# EAGLE design 527_aiblocks (EAGLE 9.6.2)
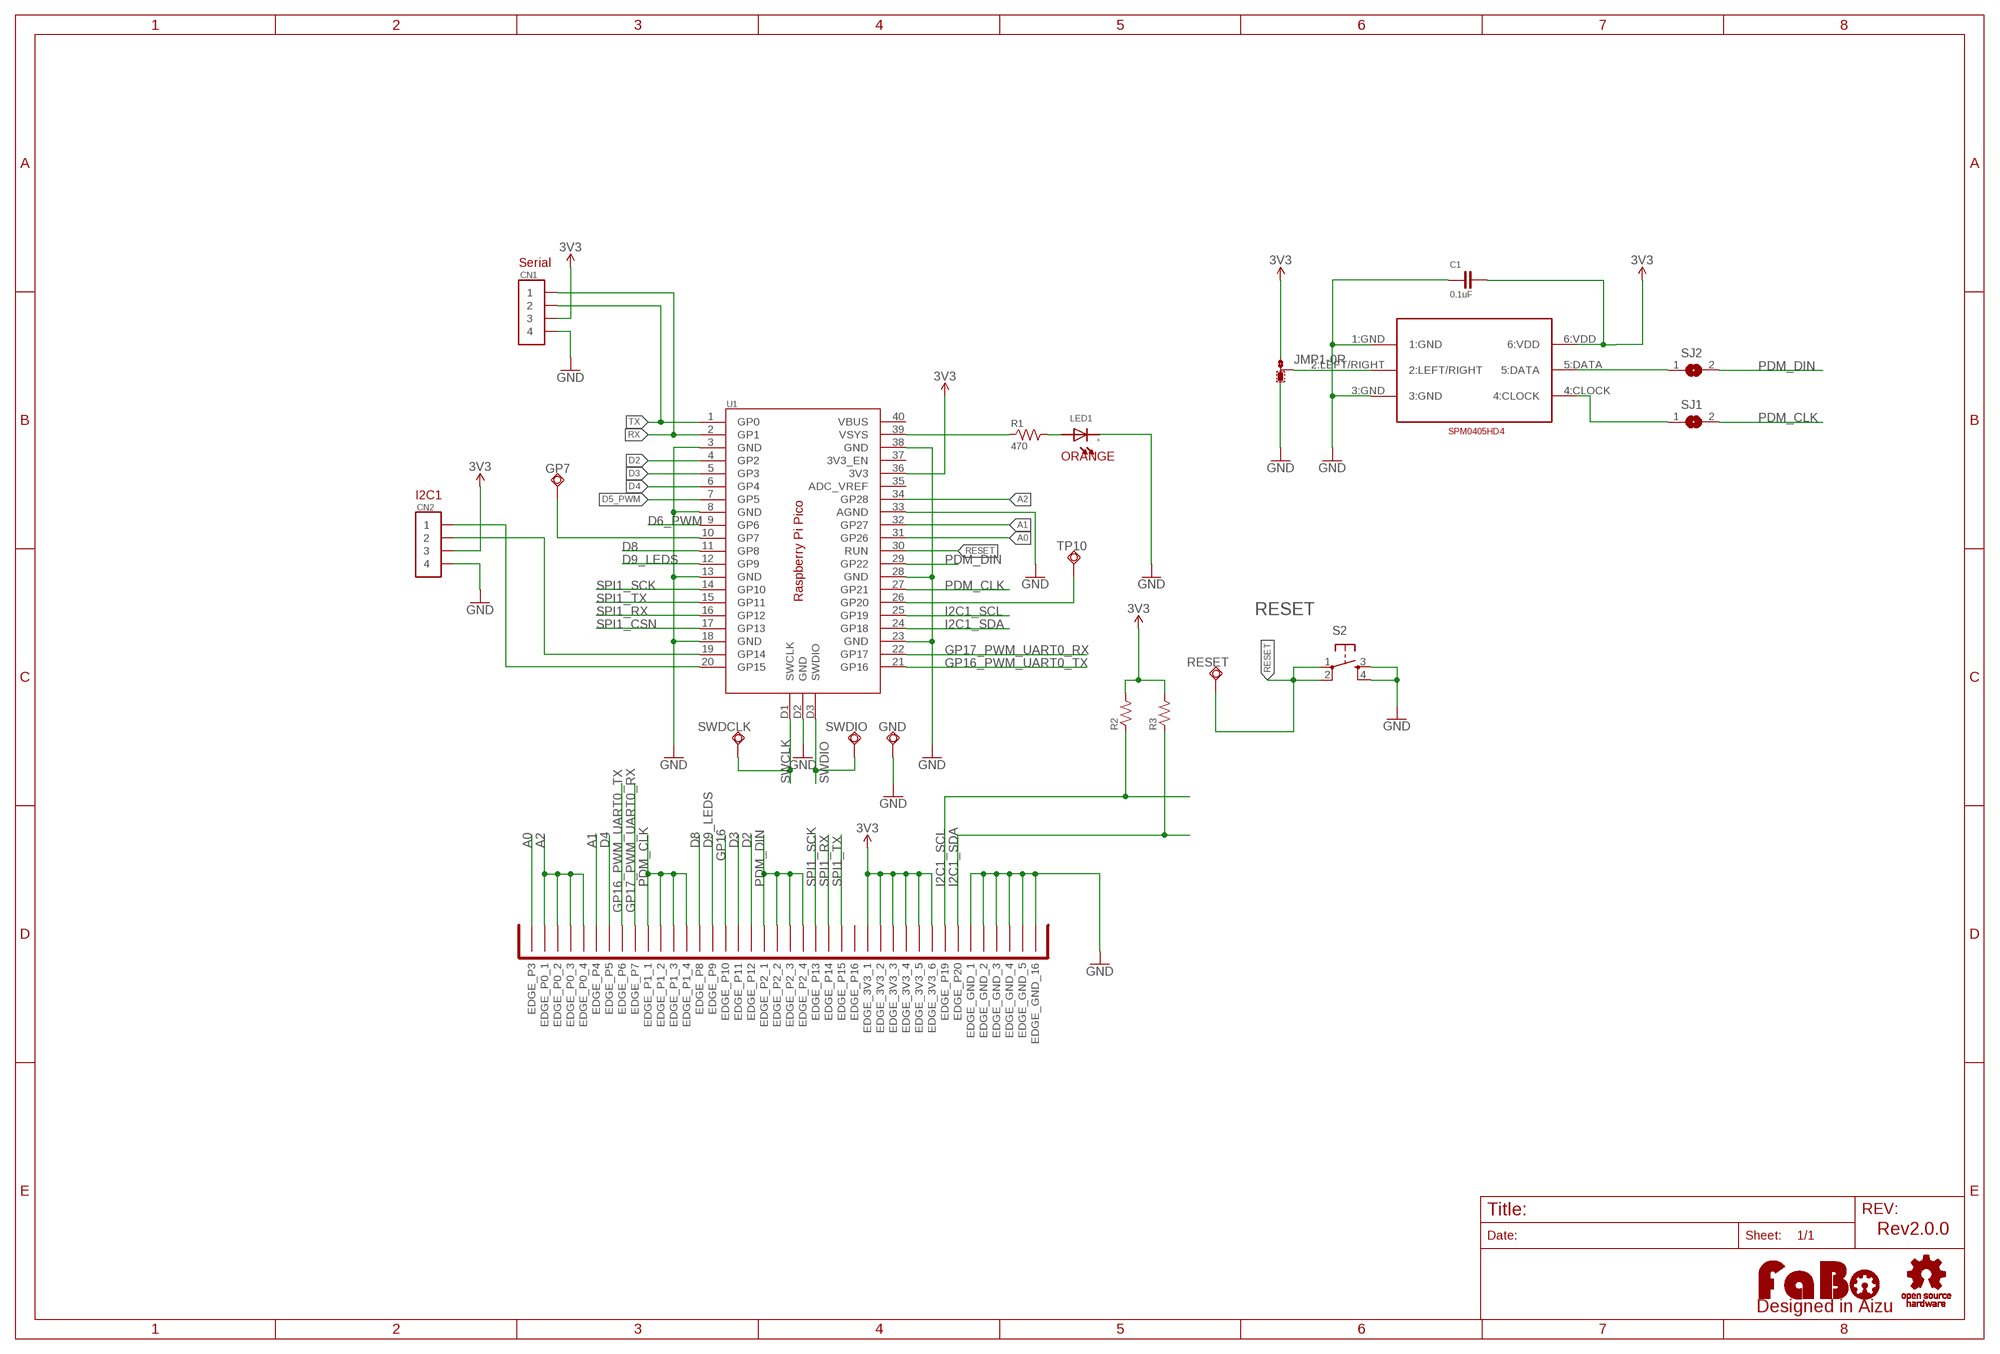
[diagram p0: schematic, sheet 1]

## Parts
C1  0.1uF  CAPACITOR-0402  [0402]
CN1  SMD-CONN-4PIN-SM04B-PASS  [SM04B-PASS]
CN2  SMD-CONN-4PIN-SM04B-PASS  [SM04B-PASS]
GND  TPSQTP20R  [TP20R]
GP7  TPSQTP20R  [TP20R]
JMP1  0R-JUMPA  [A0R-JMP]
LED1  LED-0603  [0603]
LOGO1  LOGO_OSHW-M_BOTTOM  [LOGO_OSHW_M_BOTTOM]
LOGO2  LOGO_FABO-M  [LOGO_FABO_M]
R1  470  RESISTOR-0603  [0603]
R2  RESISTOR-0603  [0603]
R3  RESISTOR-0603  [0603]
RESET  TPSQTP20R  [TP20R]
S2  TACT-SWITCH-SMD_KMR2  [KMR2]
SJ1  SJW  [SJW]
SJ2  SJW  [SJW]
SWDCLK  TPSQTP20R  [TP20R]
SWDIO  TPSQTP20R  [TP20R]
TP10  TPSQTP20R  [TP20R]
U1  RASPBERRY_PI_PICO  [RASPBERRY_PI_PICO_SMD]
U$1  SPM0405H  [SPM4050]
U$2  BBC_EDGE  [BBC_EDGE]

## Nets
3V3: C1.2 CN1.3 CN2.3 JMP1.1 R2.2 R3.2 U1.36(3V3) U$1.6:VDD U$2.P$27(EDGE_3V3_1) U$2.P$28(EDGE_3V3_2) U$2.P$29(EDGE_3V3_3) U$2.P$30(EDGE_3V3_4) U$2.P$31(EDGE_3V3_5) U$2.P$32(EDGE_3V3_6) U$2.P$67(EDGE_3V3_1) U$2.P$68(EDGE_3V3_2) U$2.P$69(EDGE_3V3_3) U$2.P$70(EDGE_3V3_4) U$2.P$71(EDGE_3V3_5) U$2.P$72(EDGE_3V3_6)
A0: U1.31(GP26) U$2.P$1(EDGE_P3) U$2.P$41(EDGE_P3)
A1: U1.32(GP27) U$2.P$6(EDGE_P4) U$2.P$46(EDGE_P4)
A2: U1.34(GP28) U$2.P$2(EDGE_P0_1) U$2.P$3(EDGE_P0_2) U$2.P$4(EDGE_P0_3) U$2.P$5(EDGE_P0_4) U$2.P$42(EDGE_P0_1) U$2.P$43(EDGE_P0_2) U$2.P$44(EDGE_P0_3) U$2.P$45(EDGE_P0_4)
D2: U1.4(GP2) U$2.P$18(EDGE_P12) U$2.P$58(EDGE_P12)
D3: U1.5(GP3) U$2.P$17(EDGE_P11) U$2.P$57(EDGE_P11)
D4: U1.6(GP4) U$2.P$7(EDGE_P5) U$2.P$47(EDGE_P5)
D5_PWM: U1.7(GP5)
D6_PWM: U1.9(GP6)
D8: U1.11(GP8) U$2.P$14(EDGE_P8) U$2.P$54(EDGE_P8)
D9_LEDS: U1.12(GP9) U$2.P$15(EDGE_P9) U$2.P$55(EDGE_P9)
GND: C1.1 CN1.4 CN2.4 GND.TP JMP1.3 LED1.CATHODE S2.3 S2.4 U1.3(GND) U1.8(GND) U1.13(GND) U1.18(GND) U1.23(GND) U1.28(GND) U1.33(AGND) U1.38(GND) U1.D2(GND) U$1.1:GND U$1.3:GND U$2.P$35(EDGE_GND_1) U$2.P$36(EDGE_GND_2) U$2.P$37(EDGE_GND_3) U$2.P$38(EDGE_GND_4) U$2.P$39(EDGE_GND_5) U$2.P$40(EDGE_GND_16) U$2.P$75(EDGE_GND_1) U$2.P$76(EDGE_GND_2) U$2.P$77(EDGE_GND_3) U$2.P$78(EDGE_GND_4) U$2.P$79(EDGE_GND_5) U$2.P$80(EDGE_GND_16)
GP14: CN2.2 U1.19(GP14)
GP15: CN2.1 U1.20(GP15)
GP16: U$2.P$16(EDGE_P10) U$2.P$56(EDGE_P10)
GP16_PWM_UART0_TX: U1.21(GP16) U$2.P$8(EDGE_P6) U$2.P$48(EDGE_P6)
GP17_PWM_UART0_RX: U1.22(GP17) U$2.P$9(EDGE_P7) U$2.P$49(EDGE_P7)
I2C1_SCL: R2.1 U1.25(GP19) U$2.P$33(EDGE_P19) U$2.P$73(EDGE_P19)
I2C1_SDA: R3.1 U1.24(GP18) U$2.P$34(EDGE_P20) U$2.P$74(EDGE_P20)
N$1: R1.1 U1.39(VSYS)
N$2: LED1.ANODE R1.2
N$3: GP7.TP U1.10(GP7)
N$4: TP10.TP U1.26(GP20)
N$5: JMP1.2 U$1.2:LEFT/RIGHT
N$6: SJ1.1 U$1.4:CLOCK
N$7: SJ2.1 U$1.5:DATA
PDM_CLK: SJ1.2 U1.27(GP21) U$2.P$10(EDGE_P1_1) U$2.P$11(EDGE_P1_2) U$2.P$12(EDGE_P1_3) U$2.P$13(EDGE_P1_4) U$2.P$50(EDGE_P1_1) U$2.P$51(EDGE_P1_2) U$2.P$52(EDGE_P1_3) U$2.P$53(EDGE_P1_4)
PDM_DIN: SJ2.2 U1.29(GP22) U$2.P$19(EDGE_P2_1) U$2.P$20(EDGE_P2_2) U$2.P$21(EDGE_P2_3) U$2.P$22(EDGE_P2_4) U$2.P$59(EDGE_P2_1) U$2.P$60(EDGE_P2_2) U$2.P$61(EDGE_P2_3) U$2.P$62(EDGE_P2_4)
RESET: RESET.TP S2.1 S2.2 U1.30(RUN)
RX: CN1.1 U1.2(GP1)
SPI1_CSN: U1.17(GP13)
SPI1_RX: U1.16(GP12) U$2.P$24(EDGE_P14) U$2.P$64(EDGE_P14)
SPI1_SCK: U1.14(GP10) U$2.P$23(EDGE_P13) U$2.P$63(EDGE_P13)
SPI1_TX: U1.15(GP11) U$2.P$25(EDGE_P15) U$2.P$65(EDGE_P15)
SWCLK: SWDCLK.TP U1.D1(SWCLK)
SWDIO: SWDIO.TP U1.D3(SWDIO)
TX: CN1.2 U1.1(GP0)
Unconnected: U1.35(ADC_VREF) U1.37(3V3_EN) U1.40(VBUS) U$2.P$26(EDGE_P16) U$2.P$66(EDGE_P16)

## Notes on the sheet
- Serial
- ORANGE
- I2C1
- RESET
- Rev2.0.0

## Library data of the parts
C1 = FaBo-Capacitor:CAPACITOR: CAPACITOR
CN1 CN2 = FaBo-Connetor:SMD-CONN-4PIN
GND GP7 RESET SWDCLK SWDIO TP10 = testpad:TPSQ: Test pad
JMP1 = jump-0r-smd:0R-JUMP: SMD 0R 0805 Jumper
LED1 = FaBo-LED:LED
LOGO1 = FaBo-Logo:LOGO_OSHW
LOGO2 = FaBo-Logo:LOGO_FABO
R1-R3 = FaBo-Resistors:RESISTOR: RESISTOR
S2 = FaBo-Switch:TACT-SWITCH: Part No Maker Datasheet Distributor 1273HA-160G-G SWITRONIC Catalog <http://www.switronic.com/uploads/images/A10.gif> Akizuki <http://akizukidenshi.com/catalog/g/gP-02561/> DTS-6-V Cosland DTS 6 Series <http://www.cosland.com/newproduct/DTS%20SERIES.pdf> Akizuki <http://akizukidenshi.com/catalog/g/gP-03647/> KMR2 C&K KMR2 SERIES <https://www.ckswitches.com/products/switches/product-details/Tactile/KMR2/> Octoparts Result <https://octopart.com/search?q=KMR2&start=0> TSHA-T-XB2-19E TOP UP INDUSTORY TSHA-T <http://www.top-up.com.tw/front/bin/ptdetail.phtml?Part=TSHA-T> Akizuki <http://akizukidenshi.com/catalog/g/gP-09361/>
SJ1 SJ2 = jumper:SJ: SMD solder JUMPER
U1 = FaBo-Boards:RASPBERRY_PI_PICO
U$1 = FaBo-Sensor:SPM0405H
U$2 = microbit:BBC_EDGE

## Board
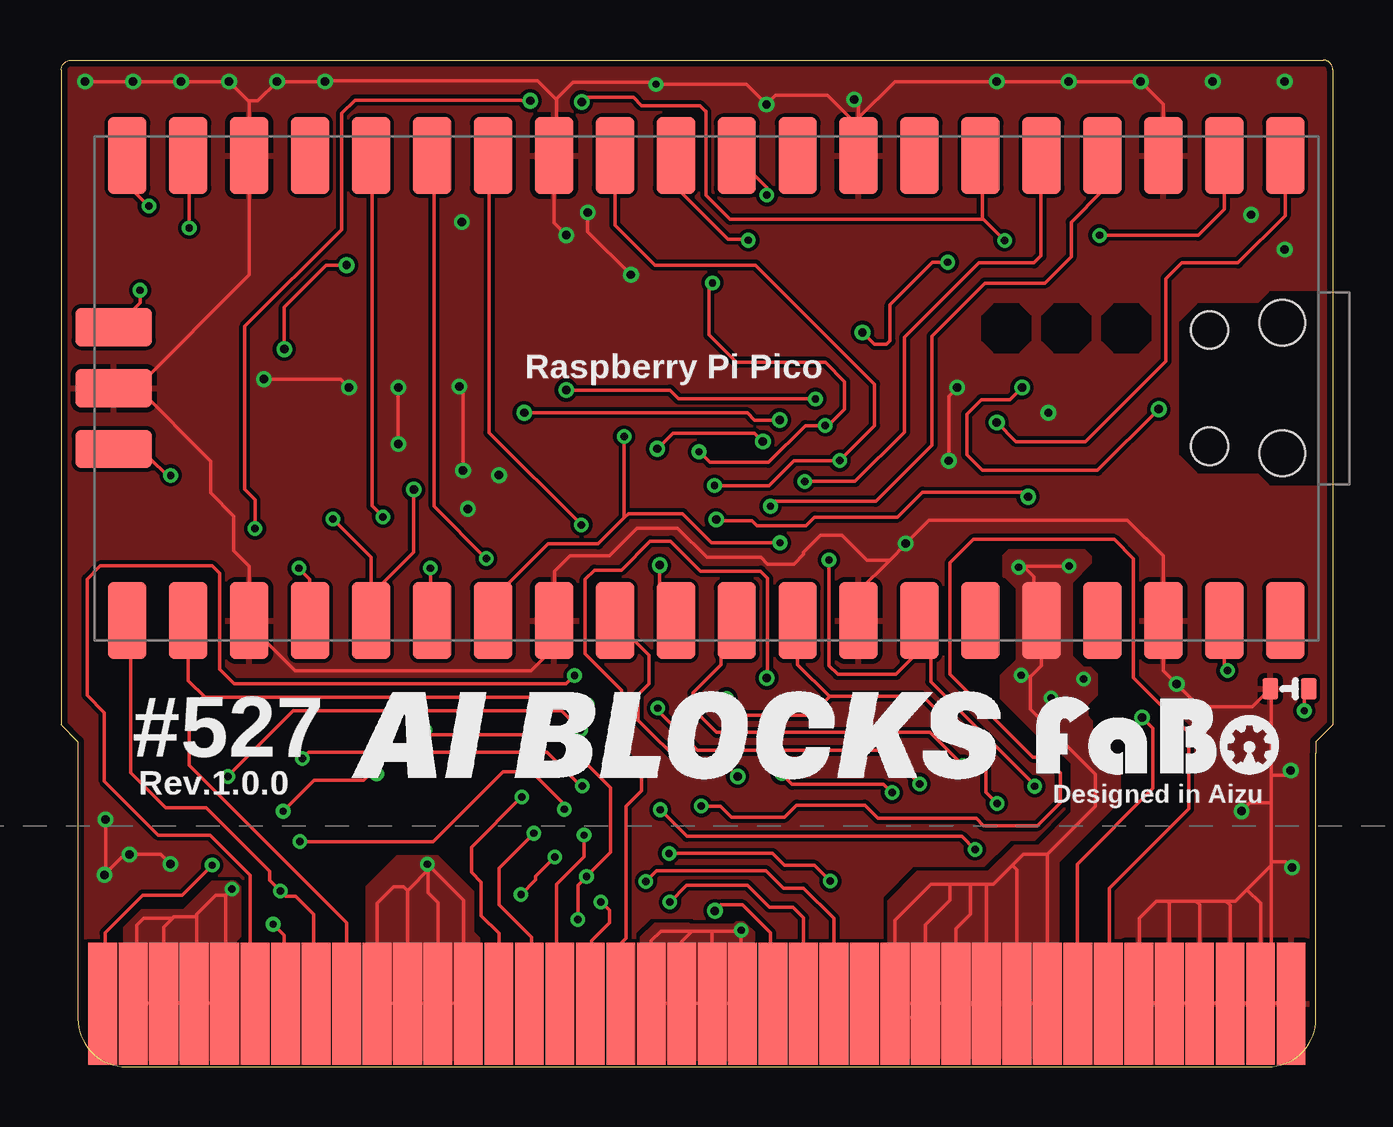
[diagram p1: board, top side]
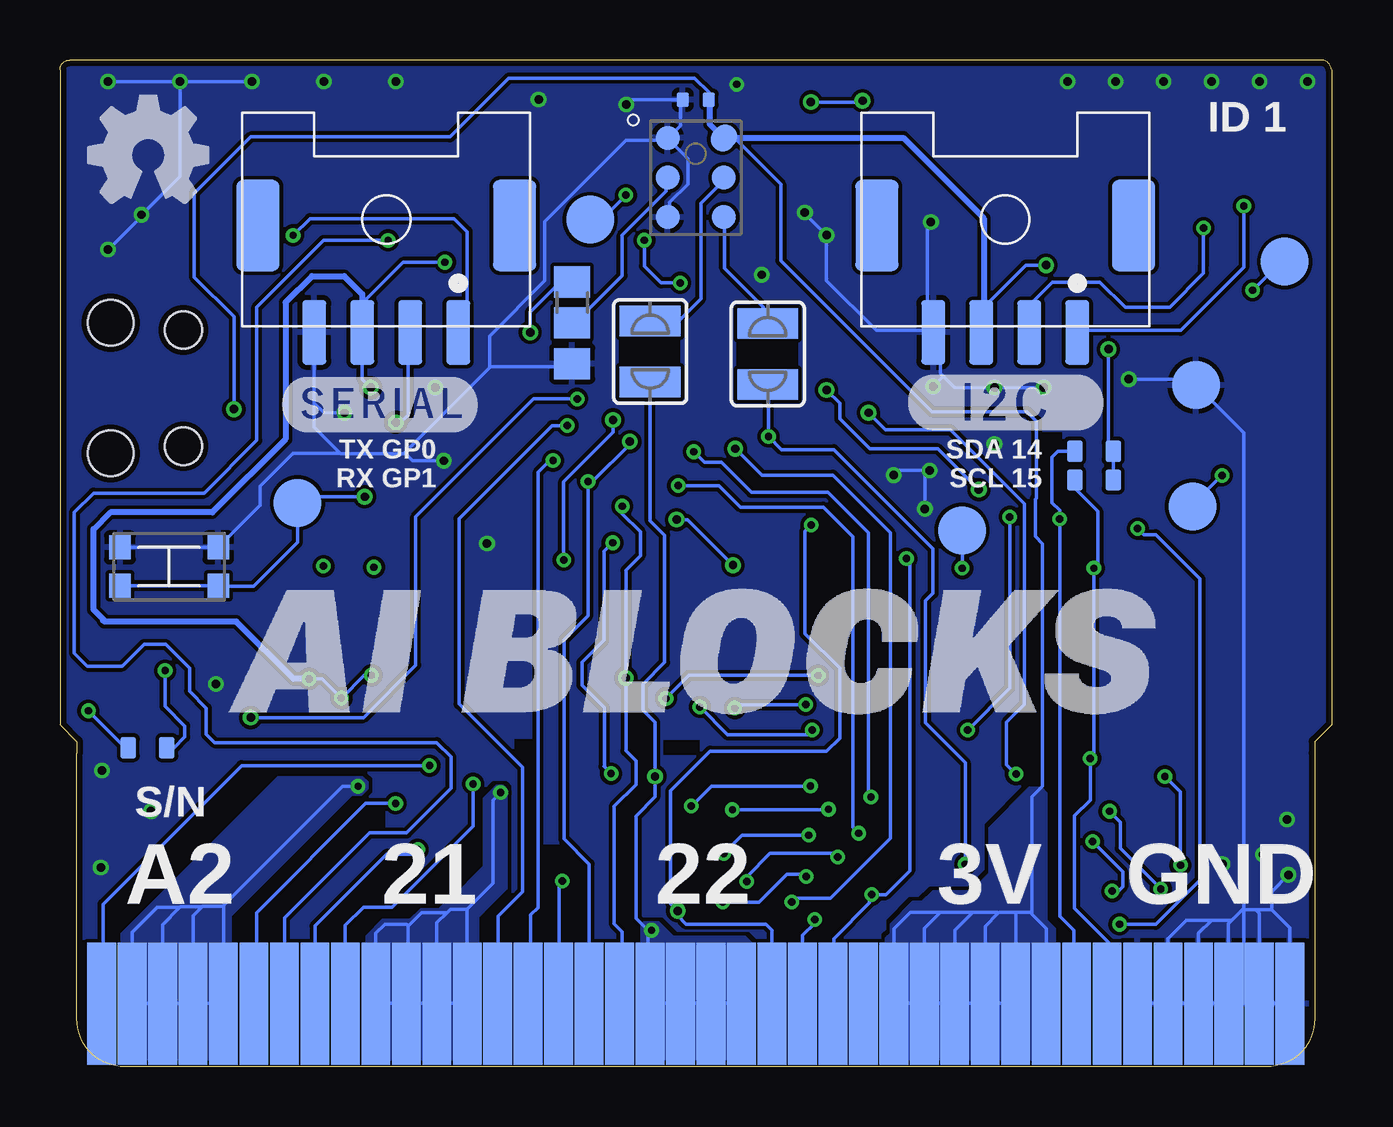
[diagram p2: board, bottom side, seen from below]

Size 53 x 41.95 mm. Coordinates in mm from the lower left corner, seen from the top.
Outline: 0.7,13.07 0.7,13.55 0,14.25 0,41.55 arc-77 0.4,41.95 52.6,41.95 arc-90 53,41.55 53,14.25 52.3,13.55 52.3,13.07
Copper layers (1*16): Top 0.035mm / dielectric 1.6mm / Bottom 0.035mm
Design rules "PCBway": minimum track width 6mil, minimum drill 12mil, track to track 6mil, track to pad 6mil, pad to pad 6mil, via to via 6mil, smd to smd 6mil, copper to edge 10mil, drill to drill 10mil, minimum pad ring 10mil, minimum via ring 6mil, stop-mask expansion 2mil, vias tented up to drill 100mil, thermal gap 8mil
bRestrict: area 22.2,29.2 to 24.8,30.2; area 27.1,29.3 to 29.7,30.3; area 11.2,25.8 to 12,26.4; area 39.5,10 to 40.2,10.6; area 38.1,8 to 38.9,8.6; area 32,8.6 to 32.8,9.2; area 26.4,13 to 27.1,13.6; area 27.1,13 to 27.9,13.6; area 33.3,13 to 34,13.6

### Footprints (pad centres in the part's own frame; a part is rotated, then mirrored left to right if it is on the bottom)
0402 = smd 0.5 x 0.6: 1 -0.55,0; 2 0.55,0
SM04B-PASS = smd 1 x 2.7: 1 3,-11.85; 2 1,-11.85; 3 -1,-11.85; 4 -3,-11.85 | smd 1.8 x 3.8: P$1 5.35,-7.4; P$2 -5.35,-7.4
TP20R = smd 2 x 2: TP 0,0
A0R-JMP = smd 1.5 x 1.3: 1 0,1.7; 2 0,0; 3 0,-1.7
0603 = smd 0.65 x 0.9: ANODE -0.8,0; CATHODE 0.8,0
0603' = smd 0.65 x 0.9: 1 -0.8,0; 2 0.8,0
KMR2 = smd 0.9 x 1: 1 -2.05,0.8; 2 2.05,0.8; 3 2.05,-0.8; 4 -2.05,-0.8
SJW = smd 1.27 x 2.54: 1 -1.27,0; 2 1.27,0
RASPBERRY_PI_PICO_SMD = smd 3.2 x 1.6: 1 -9.69,24.13; 2 -9.69,21.59; 3 -9.69,19.05; 4 -9.69,16.51; 5 -9.69,13.97; 6 -9.69,11.43; 7 -9.69,8.89; 8 -9.69,6.35; 9 -9.69,3.81; 10 -9.69,1.27; 11 -9.69,-1.27; 12 -9.69,-3.81; 13 -9.69,-6.35; 14 -9.69,-8.89; 15 -9.69,-11.43; 16 -9.69,-13.97; 17 -9.69,-16.51; 18 -9.69,-19.05; 19 -9.69,-21.59; 20 -9.69,-24.13; 21 9.69,-24.13; 22 9.69,-21.59; 23 9.69,-19.05; 24 9.69,-16.51; 25 9.69,-13.97; 26 9.69,-11.43; 27 9.69,-8.89; 28 9.69,-6.35; 29 9.69,-3.81; 30 9.69,-1.27; 31 9.69,1.27; 32 9.69,3.81; 33 9.69,6.35; 34 9.69,8.89; 35 9.69,11.43; 36 9.69,13.97; 37 9.69,16.51; 38 9.69,19.05; 39 9.69,21.59; 40 9.69,24.13 | smd 1.6 x 3.2: D1 -2.54,-24.7; D2 0,-24.7; D3 2.54,-24.7 | hole 1.9: 2.725,24; -2.725,24 | hole 1.55: 2.425,20.97; -2.425,20.97
SPM4050 = smd 1 x 1: 1:GND -1.169,1.651; 2:LEFT/RIGHT -1.169,0; 3:GND -1.169,-1.651; 4:CLOCK 1.169,-1.651; 5:DATA 1.169,0 | smd 1.15 x 1 rotated 45: 6:VDD 1.169,1.651
BBC_EDGE = smd 1.2 x 5.08: P$1 -50.215,2.673; P$2 -48.945,2.673; P$3 -47.675,2.673; P$4 -46.405,2.673; P$5 -45.135,2.673; P$6 -43.865,2.673; P$7 -42.595,2.673; P$8 -41.325,2.673; P$9 -40.055,2.673; P$10 -38.785,2.673; P$11 -37.515,2.673; P$12 -36.245,2.673; P$13 -34.975,2.673; P$14 -33.705,2.673; P$15 -32.435,2.673; P$16 -31.165,2.673; P$17 -29.895,2.673; P$18 -28.625,2.673; P$19 -27.355,2.673; P$20 -26.085,2.673; P$21 -24.815,2.673; P$22 -23.545,2.673; P$23 -22.275,2.673; P$24 -21.005,2.673; P$25 -19.735,2.673; P$26 -18.465,2.673; P$27 -17.195,2.673; P$28 -15.925,2.673; P$29 -14.655,2.673; P$30 -13.385,2.673; P$31 -12.115,2.673; P$32 -10.845,2.673; P$33 -9.575,2.673; P$34 -8.305,2.673; P$35 -7.035,2.673; P$36 -5.765,2.673; P$37 -4.495,2.673; P$38 -3.225,2.673; P$39 -1.955,2.673; P$40 -0.685,2.673 | smd 1.2 x 5.08 bottom: P$41 -0.685,2.673; P$42 -1.955,2.673; P$43 -3.225,2.673; P$44 -4.495,2.673; P$45 -5.765,2.673; P$46 -7.035,2.673; P$47 -8.305,2.673; P$48 -9.575,2.673; P$49 -10.845,2.673; P$50 -12.115,2.673; P$51 -13.385,2.673; P$52 -14.655,2.673; P$53 -15.925,2.673; P$54 -17.195,2.673; P$55 -18.465,2.673; P$56 -19.735,2.673; P$57 -21.005,2.673; P$58 -22.275,2.673; P$59 -23.545,2.673; P$60 -24.815,2.673; P$61 -26.085,2.673; P$62 -27.355,2.673; P$63 -28.625,2.673; P$64 -29.895,2.673; P$65 -31.165,2.673; P$66 -32.435,2.673; P$67 -33.705,2.673; P$68 -34.975,2.673; P$69 -36.245,2.673; P$70 -37.515,2.673; P$71 -38.785,2.673; P$72 -40.055,2.673; P$73 -41.325,2.673; P$74 -42.595,2.673; P$75 -43.865,2.673; P$76 -45.135,2.673; P$77 -46.405,2.673; P$78 -47.675,2.673; P$79 -48.945,2.673; P$80 -50.215,2.673

### Placement (x,y rotation side)
C1  26.5,40.3 0 bottom
CN1  39.4,42.45 0 bottom
CN2  13.6,42.45 0 bottom
GND  5.65,28.4 0 bottom
GP7  30.9,35.3 0 bottom
JMP1  31.65,31 0 bottom
LED1  51.2,15.75 180 top
LOGO1  49.31,37.99 0 top
LOGO2  45.72,11.8 0 top
R1  470  [0603']  49.35,13.3 180 bottom
R2  [0603']  9.9,25.65 0 bottom
R3  [0603']  9.9,24.45 0 bottom
RESET  43.1,23.5 0 bottom
S2  48.45,20.84 180 bottom
SJ1  23.5,29.7 270 bottom
SJ2  28.4,29.8 270 bottom
SWDCLK  1.95,33.55 0 bottom
SWDIO  5.8,23.35 0 bottom
TP10  15.4,22.35 0 bottom
U1  26.89,28.28 270 top
U$1  26.5,37.05 0 bottom
U$2  51.95,-0.05 0 top

### Tracks (layer width: path | path; a pad name or v marks a point on that pad's centre or on a via)
3V3  (via drill 0.3, 0.35)
  Top 0.152: U$2.P$27 34.9,2.64 35.97,2.64 U$2.P$28 | U$2.P$29 37.34,2.64 38.56,2.64 | 39.78,2.64 U$2.P$31 | 40.84,2.64 39.93,2.64 U$2.P$31 | 40.84,2.64 41,2.64 U$2.P$32 | 36.45,2.64 37.19,2.64 U$2.P$29 | 36.45,2.64 36.12,2.64 U$2.P$28 | 40.84,2.64 U$2.P$32 | v9.3,29.9 9.3,31.65 11.05,33.4 v11.9,33.4 | v33.4,30.6 33.9,30.1 34.4,30.1 34.55,30.25 34.55,31.75 36.32,33.52 v36.95,33.52 | v45.75,27.4 43.2,24.85 38.4,24.85 37.75,25.5 37.75,27.2 38.35,27.8 39.55,27.8 v40.05,28.3 | U$2.P$32 41.1,8.85 | 41.1,8.85 43.1,10.85 43.1,12.2 40.4,14.9 40.4,16.25 | 40.4,16.25 40.86,16.71 U1.36 40.55,18.9 40.55,20.41 40.1,20.86 | 41.1,8.85 40.1,8.85 39.65,8.4 | 38.6,7.6 38.85,7.6 39.65,8.4 | 38.6,7.6 37.9,7.6 | 37.9,7.6 37.05,7.6 | 37.05,7.6 36.25,7.6 34.75,6.1 34.75,2.2 34.9,2.05 35.86,2.05 36.45,2.64 | U$2.P$28 36.02,5.92 37.05,6.95 37.05,7.6 | U$2.P$29 37.3,5.74 37.9,6.35 37.9,7.6 | U$2.P$30 38.56,7.56 38.6,7.6 | U$2.P$31 39.84,8.21 39.65,8.4 | v42.02,20.86 40.1,20.86 | 40.1,20.86 39.97,20.86 v39.91,20.81 | 40.4,16.25 40.08,16.25 v40.02,16.31
  Top 1.27: 38.56,2.64 U$2.P$30
  Bottom 0.152: 13.11,2.64 U$2.P$71 | U$2.P$70 14.33,2.64 13.26,2.64 U$2.P$71 | U$2.P$69 15.85,2.64 16.92,2.64 U$2.P$68 | U$2.P$67 18.14,2.64 17.07,2.64 U$2.P$68 | U$2.P$70 14.48,2.64 15.7,2.64 U$2.P$69 | 18.29,2.64 U$2.P$67 | R2.2 | 25.91,40.23 C1.2 25.95,40.6 26.55,41.2 34.3,41.2 36.75,38.75 45.05,38.75 47.4,36.4 47.4,32.9 45.75,31.25 v45.75,27.4 | 25.45,38.76 U$1.6:VDD | 14.63,30.68 CN2.3 14.6,31.55 12.75,33.4 v11.9,33.4 | 40.39,30.98 40.39,30.68 CN1.3 | v36.95,33.52 38.7,33.52 40.81,31.41 40.39,30.98 | 40.39,30.98 CN1.3 | R2.2 R3.2 | R2.2 9.3,25.85 v9.3,29.9 | JMP1.1 32.15,32.7 33.4,31.45 v33.4,30.6 | v40.05,28.3 40.4,28.65 CN1.3 | 12.5,6.4 12.5,11.25 12.05,11.7 12.05,21.8 12.35,22.1 12.35,23.65 12.3,23.7 12.3,26.9 12.69,27.29 16.66,27.29 22.96,33.59 22.96,36.76 24.89,38.7 U$1.6:VDD | 12.5,6.4 12.5,6.35 11.89,5.74 U$2.P$72 | 25.18,38.85 U$1.6:VDD | U$2.P$70 14.44,5.86 13.9,6.4 | 13.9,6.4 13.85,6.45 13.1,6.45 | U$2.P$69 15.71,5.69 14.95,6.45 | 14.95,6.45 13.95,6.45 13.9,6.4 | U$2.P$68 16.98,5.77 16.3,6.45 | 16.3,6.45 14.95,6.45 | U$2.P$67 18.25,5.75 17.55,6.45 16.3,6.45 | v40.02,16.31 40.31,16.31 v41.27,15.36 42.06,16.16 v42.62,16.16 | 12.5,6.4 12.55,6.45 13.1,6.45 | 13.1,6.45 13.16,6.38 U$2.P$71
  Bottom 0.254: v42.62,16.16 43.26,16.16 45.65,18.55 51.15,18.55 | 51.2,18.6 51.15,18.55 | 51.15,18.55 51.15,18.6 51.6,19.05 51.6,22.4 50.9,23.1 46.65,23.1 43.6,26.15 43.6,31.85 42.5,32.95 41.15,32.95 40.4,32.2 CN1.3 | CN2.3 14.85,30.35 14.85,30 14.5,30.35 14.5,35.35 17.85,38.7 U$1.6:VDD 25.91,39.27 25.91,40.23
  pour Top (no thermals): 39.85,16.95 39.85,19.95 39.35,20.45 39.3,20.45 39.3,21.3 39.5,21.5 42.65,21.5 42.9,21.25 42.9,21 42.1,20.2 42.1,17.1 42.6,16.6 42.9,16.6 43.15,16.35 43.15,15.5 42.75,15.1 42.75,14.6 42.95,14.4 42.95,13.75 44.1,12.6 44.1,11.1 41.55,8.55 41.55,0.95 41,0.4 34.7,0.4 34.5,0.6 34.5,6.9 35.7,8.1 38.65,8.1 39.75,9.2 40.75,9.2 42.15,10.6 42.15,12.65 41.1,13.7 40.85,13.7 39.2,15.35 39.2,16.3
  pour Bottom (no thermals): 11.55,-0.1 11.55,5.75 11.9,6.1 11.9,11.4 12.1,11.6 12.6,11.6 14.25,9.95 14.25,8.05 15,7.3 16.6,7.3 17.05,6.85 17.45,6.85 18.35,5.95 18.35,5.55 18.55,5.35 18.55,0.05 18.1,-0.4 11.85,-0.4
A0  (via drill 0.3)
  Top 0.152: v37.6,12.55 36.22,13.93 27.32,13.93 26.33,14.92 v26.33,14.99 26.33,15.57 27.5,16.75 27.5,17.93 U1.31 28.04,18.49 | v6.3,8.4 5.05,7.15 3.4,7.15 1.83,5.58 1.83,2.64 U$2.P$1 | v21.65,14.03 20.85,14.83 9.68,14.83 v6.95,12.1
  Bottom 0.152: v37.6,12.55 45.43,12.55 51.21,6.77 51.21,2.64 U$2.P$41 | v6.95,12.1 6.3,11.45 v6.3,8.4 | v21.65,14.03 21.85,13.83 25.17,13.83 v26.33,14.99
A1  (via drill 0.3)
  Top 0.152: 8.23,2.64 U$2.P$6 7.88,3.09 7.88,7.98 6.21,9.65 4.05,9.65 1.8,11.9 1.8,14.76 1.08,15.48 1.08,20.31 1.63,20.87 6.3,20.87 6.61,20.56 6.61,16.57 7.22,15.95 21.05,15.95 v21.4,16.3 | U1.32 30.7,16.75 32.02,15.43 32.05,15.43 | v27.74,15.34 28.44,14.65 31.27,14.65 32.05,15.43 | v39.01,10.97 38.55,11.43 38.55,12.8 35.91,15.43 32.05,15.43
  Bottom 0.152: 44.96,2.64 U$2.P$46 44.81,2.64 44.81,6.42 40.26,10.97 v39.01,10.97 | v21.4,16.3 26.78,16.3 v27.74,15.34
A2  (via drill 0.3, 0.35)
  Top 0.152: U$2.P$3 4.27,2.64 3.05,2.64 U$2.P$2 3.15,2.77 3.15,5.9 3.45,6.2 4.65,6.2 | U$2.P$3 4.42,2.64 5.49,2.64 U$2.P$4 | U$2.P$4 5.64,2.64 6.71,2.64 U$2.P$5 6.86,2.64 6.86,7.15 | 6.86,7.15 v7.12,7.41 | v13.15,12.19 12.85,12.19 12.6,11.94 10.55,11.94 v9.25,10.65 | v32,21.11 32,16.72 32.37,16.35 34.8,16.35 35.78,17.33 U1.34 36.25,18.12 36.25,16.05 40.58,11.72 v40.58,11.69 | v29.95,26.95 28.9,26.95 28.6,27.25 v19.3,27.25 | U$2.P$4 5.65,2.73 5.65,6.25 | 5.65,6.25 5.65,6.35 6.45,7.15 6.86,7.15 | U$2.P$3 4.28,5.82 4.65,6.2 | 4.65,6.2 4.7,6.25 5.65,6.25
  Bottom 0.152: U$2.P$44 47.4,2.64 46.33,2.64 U$2.P$45 46.18,2.64 46.18,6.7 | U$2.P$43 48.62,2.64 47.55,2.64 U$2.P$44 | 49.07,2.64 48.77,2.64 U$2.P$43 | 49.07,2.64 49.99,2.64 U$2.P$42 49.99,5.6 48.95,6.65 48.05,6.65 48.02,6.62 | 49.07,2.64 U$2.P$43 | v40.58,11.69 41.21,11.69 46.18,6.72 46.18,6.7 | v9.25,10.65 8.8,10.2 8.8,9.1 v7.12,7.41 | v32,21.11 32,24.38 29.95,26.44 v29.95,26.95 | v13.15,12.19 13.55,12.59 13.55,14.35 12.8,15.1 12.8,23.46 15.89,26.55 18.6,26.55 v19.3,27.25 | U$2.P$44 47.45,6.29 47.08,6.67 | 47.08,6.67 47.05,6.7 46.18,6.7 | U$2.P$43 48.73,5.92 48.02,6.62 | 47.08,6.67 47.98,6.67 48.02,6.62
  pour Bottom (no thermals): 45.9,-0.05 45.9,6.3 41.3,10.9 40.85,11.35 40.45,11.35 40.2,11.6 40.2,11.85 40.4,12.05 43.9,12.05 50.15,5.8 50.4,5.55 50.4,5.35 50.4,-0.3 50.15,-0.55 46.35,-0.55 45.9,-0.1
  pour Top (no thermals): 2.65,-0.4 2.65,5.8 3.35,6.5 5.1,6.5 6.3,7.7 7.25,7.7 7.45,7.5 7.45,5.45 7.35,5.35 7.35,-0.1 6.75,-0.7 2.95,-0.7
D2  (via drill 0.3, 0.35)
  Top 0.152: 23.47,2.64 U$2.P$18 | 43.28,36.47 43.28,37.84 U1.4 43.4,36.5 42.1,35.2 42.1,33.75 41,32.65 38.5,32.65 36.3,30.45 36.3,25.9 33.95,23.55 29.76,23.55 v29.56,23.35 | U$2.P$18 23.37,2.66 | U$2.P$18 23.32,5.12 23.55,5.35 23.55,10.85 24.2,11.5 24.2,12.25 23.35,13.1 23.35,14.1 23.37,14.11 23.37,15.69 21.85,17.22 21.85,20.31 22.23,20.7 23.35,20.7 24.55,21.9 25.4,21.9 26.65,20.65 29.15,20.65 29.45,20.35 29.45,16.23 v29.41,16.2
  Bottom 0.152: v29.56,23.35 29.56,23.05 28.8,22.29 28.8,21.29 29.41,20.68 v29.41,16.2 29.41,13.16 29,12.75 29,11.75 29.9,10.85 29.9,5.96 29.57,5.63 29.57,2.64 U$2.P$58
D3  (via drill 0.3, 0.35)
  Top 0.152: v30.99,24.39 33.09,24.39 35.15,26.45 35.15,30.4 38.25,33.5 40.55,33.5 40.84,33.79 40.84,37.84 U1.5 | 22.5,2.8 22.18,2.67 | 22.18,2.67 U$2.P$17 | v29.25,26.05 28.9,26.4 25.5,26.4 v24.85,25.75 | v22.5,6.87 22.85,6.51 22.85,6 22.1,5.25 22.1,2.75 22.18,2.67
  Bottom 0.152: 30.99,2.66 U$2.P$57 30.95,8.44 32,9.5 32,17.8 31,18.8 31,24.38 v30.99,24.39 30.81,24.39 29.25,25.95 v29.25,26.05 | v22.5,6.87 22.35,7.02 20.9,7.02 18.39,9.53 18.39,22.25 20.79,24.65 23.75,24.65 v24.85,25.75
D4  (via drill 0.3, 0.35)
  Top 0.152: 9.45,2.64 U$2.P$7 9.3,2.64 9.3,5.48 v8.84,5.94 | 38.41,35.35 38.41,35.31 27.89,35.31 26.88,36.32 26.88,39.8 | 38.41,35.35 38.41,37.84 U1.6 | v39.32,34.43 38.41,35.35 | 26.88,39.8 26.88,39.81 | v8.08,22.42 8.08,23.62 7.65,24.05 7.65,30.85 11.69,34.88 11.69,39.72 12.25,40.28 19.2,40.28 19.23,40.25 v19.55,40.25 | v21.7,40.2 21.73,40.17 21.95,40.4 23.85,40.4 24.2,40.05 26.63,40.05 26.88,39.8
  Bottom 0.152: U$2.P$47 43.74,2.64 44.04,2.94 U$2.P$47 | v39.32,34.43 42.02,34.43 44.8,31.65 44.8,26.1 47,23.9 51.6,23.9 52.4,23.1 52.4,17.23 51.86,16.7 50.4,16.7 49.5,17.6 48.6,17.6 47.6,16.6 47.6,15.65 46.9,14.95 46.9,13.85 46.56,13.51 37.3,13.51 36.7,12.91 36.7,11.6 38.55,9.75 40.1,9.75 43.65,6.2 U$2.P$47 | v8.84,5.94 7.33,5.94 5.49,7.78 5.49,20.33 7.33,22.17 7.83,22.17 v8.08,22.42 | v21.7,40.2 19.6,40.2 v19.55,40.25
D8  (via drill 0.3)
  Top 0.152: 18.14,2.64 U$2.P$14 | v28.64,34.44 28.59,34.49 27.79,34.49 25.76,36.52 25.76,37.84 U1.11 | 18.29,2.64 U$2.P$14 | v26.58,25.63 27.03,25.18 29.48,25.18 31.02,26.72 v31.85,26.72 31.97,26.72 32.65,27.4 32.65,28.55 31.85,29.35 28.15,29.35 27,30.5 27,32.51 v27.15,32.66 | U$2.P$14 18.25,5.55 17.5,6.3 17.5,7.7 17.1,8.1 17.1,9.14 v19.2,11.24
  Bottom 0.152: v27.15,32.66 27.95,32.66 28.64,33.36 v28.64,34.44 | v31.85,26.72 32.5,26.72 36.37,22.84 36.37,15.12 33.72,12.47 33.72,7.3 34.75,6.27 34.75,2.64 U$2.P$54 | v19.2,11.24 19.3,11.34 19.3,22.24 20.98,23.93 24.18,23.93 25.43,25.18 26.13,25.18 v26.58,25.63
D9_LEDS  (via drill 0.3)
  Top 0.152: U$2.P$15 19.61,2.71 19.61,5.39 18.25,6.75 18.25,8.27 v19.71,9.73 | v27.23,24.21 29.5,24.21 30.54,25.25 v32.45,25.25 33.9,26.71 33.9,28.45 28.95,33.4 24.75,33.4 23.08,35.07 U1.12
  Bottom 0.152: v32.45,25.25 32.52,25.33 33.07,24.78 33.07,6.63 33.38,6.32 33.38,2.64 U$2.P$55 | v19.71,9.73 19.96,9.98 19.96,22.09 21.18,23.31 24.63,23.31 25.53,24.21 v27.23,24.21
GND  (via drill 0.3, 0.35)
  Top 0.152: 44.96,2.64 46.18,2.64 U$2.P$36 | 44.96,2.64 U$2.P$35 | U$2.P$37 47.55,2.64 48.62,2.64 U$2.P$38 | U$2.P$36 46.33,2.64 47.4,2.64 U$2.P$37 | 50.44,2.64 50.14,2.64 U$2.P$39 | 50.44,2.64 51.21,2.64 U$2.P$40 | U$2.P$38 48.77,2.64 49.99,2.64 U$2.P$39 | 50.29,15.9 LED1.CATHODE | 50.44,12.15 50.44,15.74 LED1.CATHODE | 50.44,12.15 50.44,11 | 50.44,11 50.44,8.55 | 50.44,8.55 50.44,8.4 | 50.44,8.4 50.44,2.64 | 50.44,2.64 U$2.P$39 | 33.22,38.15 33.38,37.99 U1.8 | 45.94,39.23 U1.3 45.94,40.11 v45,41.05 v42,41.05 v39,41.05 34.75,41.05 33.24,39.54 U1.8 | 33.22,38.15 33.75,38.67 31.94,40.48 29.78,40.48 v29.4,40.1 28.56,40.93 v24.8,40.93 24.7,41.03 21.33,41.03 20.62,40.32 | 33.22,38.15 U1.8 | 3.16,28.32 6.24,25.24 6.24,23.91 7.2,22.95 7.2,21.5 7.84,20.86 U1.23 | 7.77,18.49 9.75,16.51 19.59,16.51 20.54,17.46 U1.28 20.57,18.64 20.57,20.65 21.22,21.3 22.85,21.3 24,22.45 25.7,22.45 26.92,21.22 29.17,21.22 29.45,20.95 30.55,20.95 30.95,21.35 30.95,21.45 31.65,22.15 32.55,22.15 33.59,21.11 34.54,21.11 | 3.16,28.32 2.69,27.84 2.29,28.24 U1.D2 | v12,28.3 11.65,28.65 v8.45,28.65 | U1.33 33.24,19.81 34.54,21.11 | LED1.CATHODE 49.65,15 47.45,15 v46.5,15.95 45.94,16.51 U1.38 45.94,21.28 44.45,22.77 36.18,22.77 v35.2,21.8 35.2,21.77 34.54,21.11 | U1.18 7.84,37.91 | U1.18 7.84,32.99 3.16,28.32 | 20.62,40.32 19.86,41.08 11.04,41.08 v11,41.05 v9,41.05 8.2,40.25 7.8,40.25 | 20.62,40.32 20.65,40.3 20.65,38.08 U1.13 20.54,35.16 v21.05,34.65 | 50.44,8.4 49.42,7.38 | 49.42,7.38 48.94,6.9 48.55,6.9 | 44.96,2.64 44.95,2.65 44.95,6.2 45.65,6.9 46.1,6.9 | 48.55,6.9 47.3,6.9 | 47.3,6.9 46.1,6.9 | U$2.P$36 46.19,6.81 46.1,6.9
  Top 0.152: U$2.P$37 47.45,6.74 47.3,6.9 | U$2.P$38 48.73,6.72 48.55,6.9 | U$2.P$39 49.99,6.8 49.42,7.38 | U1.8 33.24,40.11 v33.05,40.3 | v37.35,28.3 37,27.95 v37,25.25 | v1,41.05 v3,41.05 v5,41.05 v7,41.05 7.8,40.25 | 7.8,40.25 7.84,40.21 U1.18 | v1.85,10.3 1.85,8.05 v1.8,8 2.65,8.85 v2.85,8.85 4.15,8.85 v4.55,8.45 | v23.75,33 21.95,34.8 v21.95,35.6 | v51.3,8.3 51.05,8.55 50.44,8.55 | v49.2,10.65 49.55,11 50.44,11 | v51.25,12.35 51.05,12.15 50.44,12.15 | v14.05,25.95 v14.05,28.3 | v16.75,24.85 16.75,28.2 v16.6,28.35
  Bottom 0.152: U$2.P$79 2.9,2.64 1.83,2.64 U$2.P$80 1.74,5.78 2.5,6.55 | 4.3,2.62 4.42,2.64 5.49,2.64 U$2.P$77 | 4.3,2.62 U$2.P$78 4.27,2.64 3.66,2.64 | U$2.P$76 6.71,2.64 5.64,2.64 U$2.P$77 | U$2.P$76 6.86,2.64 8.08,2.64 U$2.P$75 | 3.66,2.64 3.05,2.64 U$2.P$79 | 16.46,30.22 16.46,30.53 CN2.4 | 5.79,28.55 5.67,28.42 | 5.67,28.42 GND.TP 3.66,26.41 3.66,6.6 | 27.13,40.23 27.13,39.21 27.58,38.76 U$1.1:GND | 27.13,40.23 27.13,40.28 29.22,40.28 v29.4,40.1 | 27.13,40.23 C1.1 | U$1.3:GND 27.58,35.4 27.58,36.01 26.82,36.77 26.82,37.84 27.58,38.6 U$1.1:GND | 35.06,29.16 35.1,29.16 35.1,30.45 32.8,32.75 32.8,35.22 29.41,38.6 27.74,38.6 U$1.1:GND | 35.06,29.16 31.7,29.16 JMP1.3 | 42.8,30.2 CN1.4 42.4,27.65 | 16.65,30.68 18.98,30.68 21.05,32.75 v21.05,34.65 21.95,35.55 v21.95,35.6 | 16.65,30.68 16.61,30.68 CN2.4 | 3.66,6.6 3.66,6.55 | 3.66,6.55 3.66,2.64 | CN2.4 16.3,30.3 16.3,28.9 16.18,28.77 | 16.18,28.77 15.7,28.3 v14.05,28.3 v12,28.3 | v8.45,28.65 5.9,28.65 5.67,28.42 | 42.4,27.65 42.4,26.65 41.33,25.57 | 35.06,29.16 38.63,25.58 | 38.63,25.58 38.67,25.55 41.3,25.55 41.33,25.57 | 41.33,25.57 43.27,25.57 44.65,24.2 44.65,23.39 S2.4 S2.3 | 3.66,6.6 4.18,6.08 | 4.18,6.08 4.3,5.95 4.3,2.62 | U$2.P$77 5.54,5.55 5,6.1 | 5,6.1 4.2,6.1 4.18,6.08 | U$2.P$76 6.82,5.33 6.05,6.1 5,6.1 | 2.5,6.55 3.15,6.55 | 3.15,6.55 3.66,6.55 | U$2.P$79 3,6.4 3.15,6.55 | v37,25.25 38.3,25.25 38.63,25.58 | v41.15,27.25 42,27.25 42.4,27.65 | v51,34.05 49.6,35.45 v49.6,35.5 48,37.1 v48,41.05 | v48,41.05 v51,41.05 | v48,41.05 v45,41.05 | v1.8,8 2.5,7.3 2.5,6.55 | v16.7,35.2 16.85,35.05 16.85,30.88 16.65,30.68 | v16.6,28.35 16.18,28.77 | v18.25,24.65 18.05,24.85 v16.75,24.85 16.95,24.65 v16.95,23.25
  pour Top (rank 6): -7.05,54.3 60.9,54.3 60.9,-10.8 -7.05,-10.8
  pour Bottom (rank 6): -7.1,54.9 61.45,54.9 61.45,-11.45 -7.1,-11.45
GP14  (via drill 0.3)
  Top 0.152: v5.33,34.95 5.33,37.93 U1.19
  Bottom 0.152: CN2.2 12.6,31.73 11.63,32.7 9.65,32.7 8.6,31.65 6.75,31.65 5.33,33.06 5.33,33.4 5.33,33.45 v5.33,34.95
GP15  (via drill 0.3)
  Top 0.152: U1.20 2.76,36.76 v3.66,35.86
  Bottom 0.152: v3.66,35.86 3.66,33.31 6.29,30.68 10.52,30.68 CN2.1
GP16  (via drill 0.3)
  Top 0.152: 20.73,2.64 20.76,2.63 | 20.76,2.63 U$2.P$16 20.88,2.64 | v32.06,7.74 31.41,8.39 30.16,8.39 29.65,8.89 v25.34,8.89 | v21.79,9.65 21.79,8.74 20.65,7.6 20.65,3.35 20.8,3.2 20.8,2.66 20.76,2.63
  Bottom 0.152: v21.79,9.65 24.58,9.65 v25.34,8.89 | v32.06,7.74 32.21,7.59 32.21,2.62 U$2.P$56
GP16_PWM_UART0_TX  (via drill 0.3)
  Top 0.152: 10.67,2.64 U$2.P$8 10.52,2.64 10.52,6.35 9.77,7.1 9.36,7.1 v9.14,7.32 8.7,7.76 8.7,8.15 6.05,10.8 4.35,10.8 2.9,12.25 2.9,18.49 U1.21 | v38.09,9.05 37.54,9.6 26.08,9.6 v24.97,10.71 | v20.97,10.73 20.97,10.93 19.6,12.3 18.42,12.3 15.5,9.38 v9.95,9.38
  Bottom 0.152: v24.97,10.71 21.24,10.71 21.22,10.73 v20.97,10.73 | v9.14,7.32 8.89,7.32 8.7,7.51 8.7,8.13 v9.95,9.38 | U$2.P$48 42.37,2.64 42.37,5.87 39.39,8.85 38.29,8.85 v38.09,9.05
GP17_PWM_UART0_RX  (via drill 0.3)
  Top 0.152: v35.78,11.79 34.38,13.19 26.52,13.19 24.87,14.84 v24.87,14.94 | 6,15.39 21.62,15.39 v21.92,15.09 | 6,15.39 5.9,15.39 5.33,14.82 5.33,12.56 11.89,6 U$2.P$9 | U1.22 5.3,16.09 6,15.39
  Bottom 0.152: v21.92,15.09 24.72,15.09 v24.87,14.94 | 41,2.64 U$2.P$49 41.1,5.89 40.35,6.65 39.15,6.65 35.78,10.01 v35.78,11.79
I2C1_SCL  (via drill 0.3, 0.35)
  Top 0.152: v31.44,27.83 25.74,27.83 25.37,28.2 v21.05,28.2 | U$2.P$33 42.35,2.65 42.35,8.45 45.5,11.6 45.5,14.1 v45.05,14.55 | v11.33,22.82 12.92,21.23 U1.25 12.92,19.67 14.7,21.45 v14.7,24.05
  Bottom 0.152: 10.52,2.64 U$2.P$73 10.67,2.64 10.67,1.98 10.7,1.95 10.75,1.95 10.75,5.7 11.33,6.28 v11.33,22.82 11.33,23.18 11.65,23.5 11.65,25.4 11.4,25.65 R2.1 | v31.44,27.83 33.25,27.83 38.17,22.91 38.17,16.73 40.35,14.55 v45.05,14.55 | v14.7,24.05 16.4,25.75 19.25,25.75 20.5,27 20.5,27.65 v21.05,28.2
I2C1_SDA  (via drill 0.3)
  Top 0.152: v9.91,20.77 10.36,20.32 10.36,18.64 U1.24 | v21.72,11.69 21.66,11.69 20.25,13.1 10.31,13.1 v10.06,12.85 | 43.74,2.64 U$2.P$34 43.7,2.68 43.7,7.45 47,10.75 47,13.91 44.7,16.21 44.7,21.16 43.9,21.97 38.02,21.97 37.05,21 37.05,16.35 40.5,12.9 41,12.9 41.65,12.25 41.65,11 40.7,10.05 38.45,10.05 38.15,10.35 34.05,10.35 33.5,10.9 30.65,10.9 30.15,10.4 27.95,10.4 27.49,10.86 v26.68,10.86
  Bottom 0.152: v10.06,12.85 10.06,11.11 10.71,10.45 10.71,6.61 9.25,5.15 9.25,2.7 | 9.25,2.7 9.14,2.79 9.3,2.64 U$2.P$74 9.25,2.7 | v26.68,10.86 25.85,11.69 v21.72,11.69 | v10.06,12.85 9.91,12.85 v9.91,20.77 9.75,20.93 9.75,23.15 10.7,24.1 R3.1 | v10.06,12.85
N$1  (via drill 0.3)
  Top 0.152: v48.62,16.51 48.48,16.64 U1.39
  Bottom 0.152: 48.62,13.31 R1.1 48.25,13.3 47.8,13.75 47.8,14.2 48.62,15.01 v48.62,16.51
N$2  (via drill 0.3)
  Top 0.152: v51.82,14.83 51.82,15.59 51.97,15.74 LED1.ANODE
  Bottom 0.152: v51.82,14.83 50.29,13.31 R1.2
N$3  (via drill 0.3)
  Top 0.152: v29.41,36.32 29.41,36.62 28.19,37.84 U1.10
  Bottom 0.152: v29.41,36.32 30.33,35.4 30.79,35.4 GP7.TP
N$4  (via drill 0.3)
  Top 0.152: v15.39,20.77 15.39,18.64 U1.26
  Bottom 0.152: v15.39,20.77 15.39,22.3 TP10.TP
N$5
  Bottom 0.152: U$1.2:LEFT/RIGHT 27.74,36.93 27.74,36.47 29.57,34.64 29.57,32.96 31.55,30.98 JMP1.2
N$6
  Bottom 0.152: U$1.4:CLOCK 25.3,35.25 25.3,33.27 23.7,31.67 SJ1.1
N$7
  Bottom 0.152: SJ2.1 27.23,31.07 26.29,32.01 26.29,35.98 25.45,36.82 25.45,36.93 U$1.5:DATA
PDM_CLK  (via drill 0.3)
  Top 0.152: U$2.P$11 14.33,2.64 13.26,2.64 U$2.P$10 13.16,6.81 13.85,7.5 14.27,7.5 14.44,7.33 | U$2.P$12 15.85,2.64 16.92,2.64 U$2.P$13 16.77,2.83 16.77,6.94 15.4,8.3 | U$2.P$11 14.48,2.64 15.7,2.64 U$2.P$12 | U1.27 18,19.5 | 18,19.5 18,19.76 | v15.27,8.44 15.3,8.4 | 15.3,8.4 15.4,8.3 | v34.63,11.42 34.28,11.77 30.47,11.77 v30.03,12.21 | 29.91,21.78 v29.96,21.83 27.11,21.83 25.9,23.05 23.65,23.05 23.47,22.87 | 18,19.5 20.29,21.78 22.39,21.78 23.47,22.87 | v23.47,26.26 23.47,22.87 | U$2.P$11 14.44,7.33 | 14.44,7.33 15.4,8.3 | U$2.P$12 15.71,6.84 15.3,7.25 15.3,8.4
  Bottom 0.152: 38.71,2.64 39.78,2.64 U$2.P$50 39.84,5.56 39.45,5.95 38.55,5.95 38.48,5.87 | U$2.P$52 37.19,2.64 36.12,2.64 U$2.P$53 | 38.5,2.64 37.34,2.64 U$2.P$52 | 38.5,2.64 38.56,2.64 U$2.P$51 | SJ1.2 23.47,28.4 v23.47,26.26 22.92,25.71 20.75,25.71 16.61,21.58 16.61,19.72 16.92,19.41 16.92,14.33 15.27,12.67 v15.27,8.44 | 30.33,12.51 30.31,12.49 | 30.31,12.49 v30.03,12.21 | v29.96,21.83 30.33,21.47 30.33,17.77 31.25,16.85 31.25,15.9 30.31,14.95 30.31,12.49 | 35.97,2.64 U$2.P$53 | U$2.P$53 36.02,6.57 | v34.63,11.42 34.95,11.1 34.95,7.65 36.02,6.57 | 36.02,6.57 36.73,6.57 36.88,6.42 | U$2.P$52 37.3,6 36.88,6.42 | 36.88,6.42 37.92,6.42 38.48,5.87 | 38.5,2.64 38.5,5.85 38.48,5.87
  pour Bottom (no thermals): 35.7,0.2 35.6,0.3 35.6,5.9 35.6,6.25 34.8,7.05 34.4,7.45 34.4,10.55 34.4,11.55 34.5,11.65 34.55,11.7 34.8,11.7 35.3,11.2 35.3,8.35 36.7,6.95 36.8,6.95 37.2,6.55 37.95,6.55 38.4,6.1 39.2,6.1 39.55,6.1 40.2,5.45 40.2,-0.05 39.8,-0.45 38.95,-0.45 36.35,-0.45
  pour Top (no thermals): 12.75,-0.35 12.75,7.5 13.95,8.7 14,8.75 15.7,8.75 17.15,7.3 17.15,5.6 17.4,5.35 17.4,5.1 17.4,-0.15 17.3,-0.25 17.05,-0.5 12.95,-0.5 12.9,-0.5
PDM_DIN  (via drill 0.3, 0.35)
  Top 0.152: U$2.P$62 24.69,2.64 25.76,2.64 U$2.P$61 | 28.35,2.64 27.28,2.64 U$2.P$21 | U$2.P$61 25.91,2.64 27.13,2.64 U$2.P$21 | U1.29 24.51,17.16 24.51,15.96 24.05,15.5 24.05,14.45 26,12.5 27.8,12.5 v28.2,12.1 | 24.54,2.64 U$2.P$62 | v28.35,5.69 28.35,5.65 | 28.35,5.65 28.35,2.64 | 28.35,2.64 U$2.P$22 | U$2.P$61 25.86,5.21 26.3,5.65 | 26.3,5.65 27.2,5.65 | 27.2,5.65 28.35,5.65 | U$2.P$21 27.14,5.58 27.2,5.65 | U$2.P$62 24.59,5.24 25,5.65 26.3,5.65
  Bottom 0.152: 24.54,2.64 U$2.P$62 24.69,2.64 25.76,2.64 U$2.P$61 25.91,2.64 27.13,2.64 U$2.P$21 27.28,2.64 28.35,2.64 U$2.P$22 28.5,2.64 28.5,5.69 | 28.5,5.69 v28.35,5.69 28.2,5.69 | SJ2.2 28.4,22.75 27.8,22.15 27.8,16.85 28.7,15.95 28.7,14.85 28.2,14.35 v28.2,12.1 28.2,11.25 29,10.45 29,6.19 28.5,5.69
  pour Top (no thermals): 24.2,-0.05 24.2,5.4 24.75,5.95 26.15,5.95 26.2,5.9 28.05,5.9 28.15,6 28.45,6 28.55,5.9 28.85,5.6 28.85,-0.25 28.5,-0.6 24.6,-0.6 24.2,-0.2
  pour Bottom (no thermals): 24.1,0.05 24.1,5.05 24.45,5.4 27.45,5.4 28.05,6 28.65,6 28.75,5.9 28.75,0 28.45,-0.3 24.3,-0.3 24.1,-0.1 24.1,0
RESET  (via drill 0.35)
  Top 0.152: U1.30 24.95,19.26 v24.95,20.9 | v27.3,22.8 27.35,22.75 28.8,22.75 29,22.55 31.05,22.55 31.4,22.9 34.85,22.9 35.9,23.95 40.1,23.95 v40.3,23.75
  Bottom 0.152: S2.1 46.54,20.01 44.94,20.01 43.1,21.85 RESET.TP 42.85,23.75 v40.3,23.75 | v24.95,20.9 26.85,22.8 v27.3,22.8 | 46.31,20.12 S2.1 | S2.1 S2.2
RX  (via drill 0.3)
  Top 0.152: U1.2 48.48,35.73 47.4,34.64 v43.28,34.64
  Bottom 0.152: CN1.1 36.02,30.97 36.02,34.8 36.56,35.34 42.58,35.34 v43.28,34.64
SPI1_RX  (via drill 0.3)
  Top 0.152: 31.09,2.64 U$2.P$24 | v13.41,22.91 12.95,23.36 12.95,37.84 U1.16 | v15.16,14.03 15.36,13.83 20.69,13.83 22.9,11.62 22.9,8.93 v21.9,7.93 21.54,7.57 v21.54,6.14 | v25.37,6.86 26.07,7.56 28.6,7.56 29.51,6.65 30.5,6.65 30.95,6.2 U$2.P$24 | 30.94,2.64 U$2.P$24
  Bottom 0.152: v13.41,22.91 13.41,15.78 v15.16,14.03 | 21.95,2.64 U$2.P$64 22.05,5.47 21.54,5.99 v21.54,6.14 | v21.9,7.93 22,8.03 22.7,8.03 23.86,6.86 v25.37,6.86
SPI1_SCK  (via drill 0.3, 0.35)
  Top 0.152: 29.72,2.64 U$2.P$23 29.57,2.64 29.57,5.58 28.4,6.75 27.5,6.75 v27.25,6.5 | U1.14 17.83,37.8 17.83,26.42 v21.68,22.57
  Bottom 0.152: U$2.P$63 23.32,2.64 23.32,5.69 23.58,5.95 26.9,5.95 27.25,6.3 v27.25,6.5 27.55,6.8 27.55,11.5 25.9,13.15 21.05,13.15 20.5,13.7 20.5,16.6 21.95,18.05 21.95,22.31 v21.68,22.57
SPI1_TX  (via drill 0.3)
  Top 0.152: v17.72,21.17 15.54,23.35 15.54,37.84 U1.15 | v24.37,7.72 24.82,8.17 29.37,8.17 30.1,7.45 30.95,7.45 32.22,6.18 U$2.P$25 32.16,2.64 | v20.58,8.74 19.78,7.94 19.78,7.79 v19.17,7.17
  Bottom 0.152: v17.72,21.17 17.58,21.03 17.58,8.17 18.58,7.17 v19.17,7.17 19.27,7.17 19.27,6.82 20.75,5.34 20.75,2.66 U$2.P$65 20.73,2.64 20.73,4.92 | v24.37,7.72 24.37,7.92 23.4,8.89 20.73,8.89 v20.58,8.74
SWCLK  (via drill 0.3)
  Top 0.152: v3.29,32.35 3.29,31.84 2.29,30.83 U1.D1
  Bottom 0.152: v3.29,32.35 2.1,33.55 SWDCLK.TP
SWDIO  (via drill 0.3)
  Top 0.152: v4.57,24.64 4.42,24.64 3.72,25.34 2.6,25.34 2.29,25.65 U1.D3
  Bottom 0.152: v4.57,24.64 5.74,23.47 SWDIO.TP
TX  (via drill 0.35)
  Top 0.152: U1.1 51.02,35.47 49.05,33.5 46.71,33.5 46.05,32.84 46.05,29.4 42.7,26.05 39.8,26.05 v39,26.85
  Bottom 0.152: v39,26.85 38.8,26.85 38.5,27.15 38.5,30.5 CN1.2

### Text on the board
tPlace: Raspberry Pi Pico | #527 | Designed in Aizu | Rev.1.0.0
bPlace: ID 1 | SDA 14 | TX GP0 | SCL 15 | RX GP1 | S/N | GND | 3V | 22 | 21 | A2
Document: FaBo AI BLOCKS / Raspberry Pi Pico CardEdge / 2022/06/10 Rev1.0.0
bDocu: MIC | RESET